# EAGLE design untitled (EAGLE 6.1)
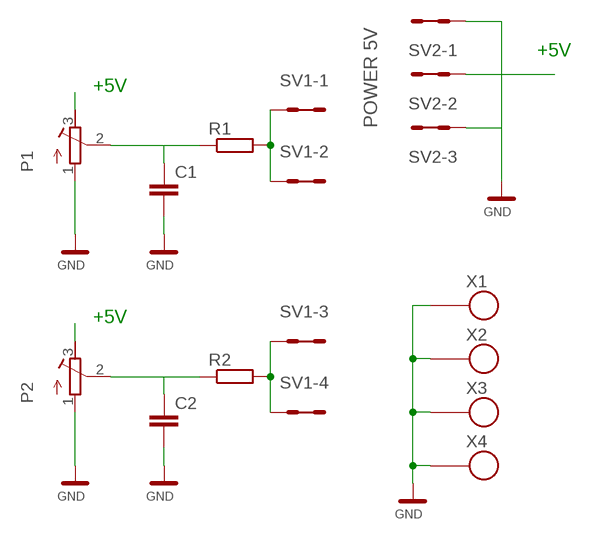
[diagram p0: schematic, sheet 1]

## Parts
C1  C0805  [C0805]
C2  C0805  [C0805]
P1  TRIM_CA9MTV10  [TRIM_CA9MTV10]
P2  TRIM_CA9MTV10  [TRIM_CA9MTV10]
R1  R0805  [0805]
R2  R0805  [0805]
SV1  MA04-2  [MA04-2]
SV2  MA03-2  [MA03-2]
X1  SROUB3M  [SROUB3M]
X2  SROUB3M  [SROUB3M]
X3  SROUB3M  [SROUB3M]
X4  SROUB3M  [SROUB3M]

## Nets
+5V: P1.3 P2.3 SV2.3 SV2.4
GND: C1.2 C2.2 P1.1 P2.1 SV2.1 SV2.2 SV2.5 SV2.6 X1.P$1 X2.P$1 X3.P$1 X4.P$1
N$1: R2.2 SV1.5 SV1.6 SV1.7 SV1.8
N$2: C1.1 P1.2 R1.1
N$4: R1.2 SV1.1 SV1.2 SV1.3 SV1.4
N$5: C2.1 P2.2 R2.1

## Notes on the sheet
- +5V
- +5V
- POWER 5V
- +5V

## Library data of the parts
C1 C2 = moje_C:C0805
P1 P2 = moje_pot:TRIM_CA9MTV10
R1 R2 = moje_R:R0805
SV1 = moje_hrebinky:MA04-2: PIN HEADER; OC_FARNELL: unknown; OC_NEWARK: unknown
SV2 = moje_hrebinky:MA03-2: PIN HEADER; OC_FARNELL: unknown; OC_NEWARK: unknown
X1-X4 = moje:SROUB3M

## Board
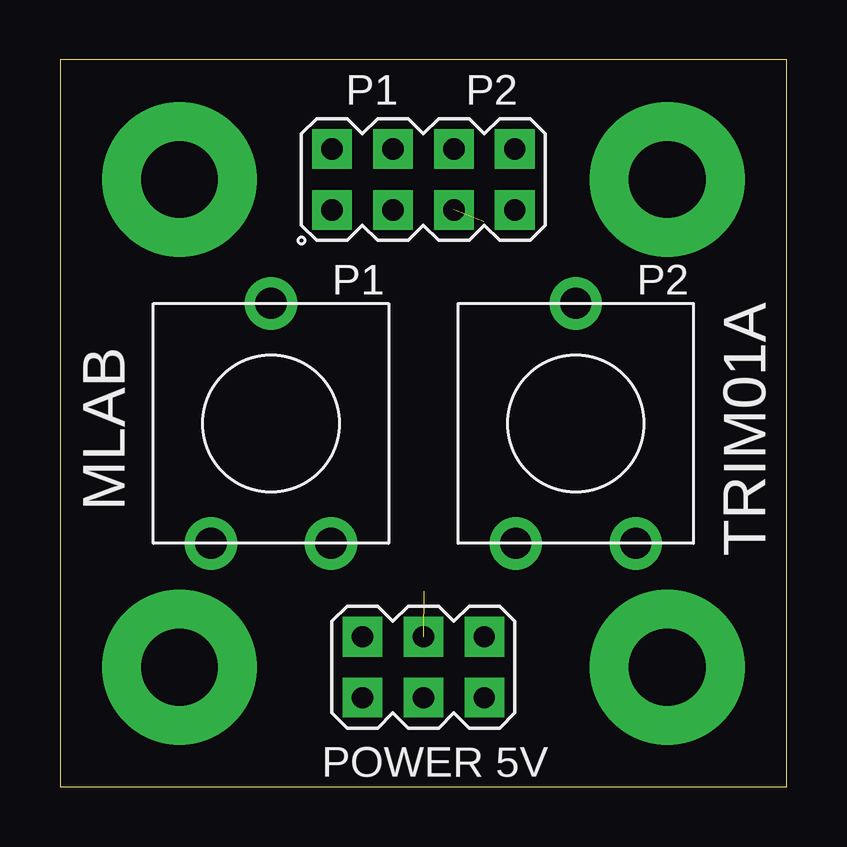
[diagram p1: board, top side]
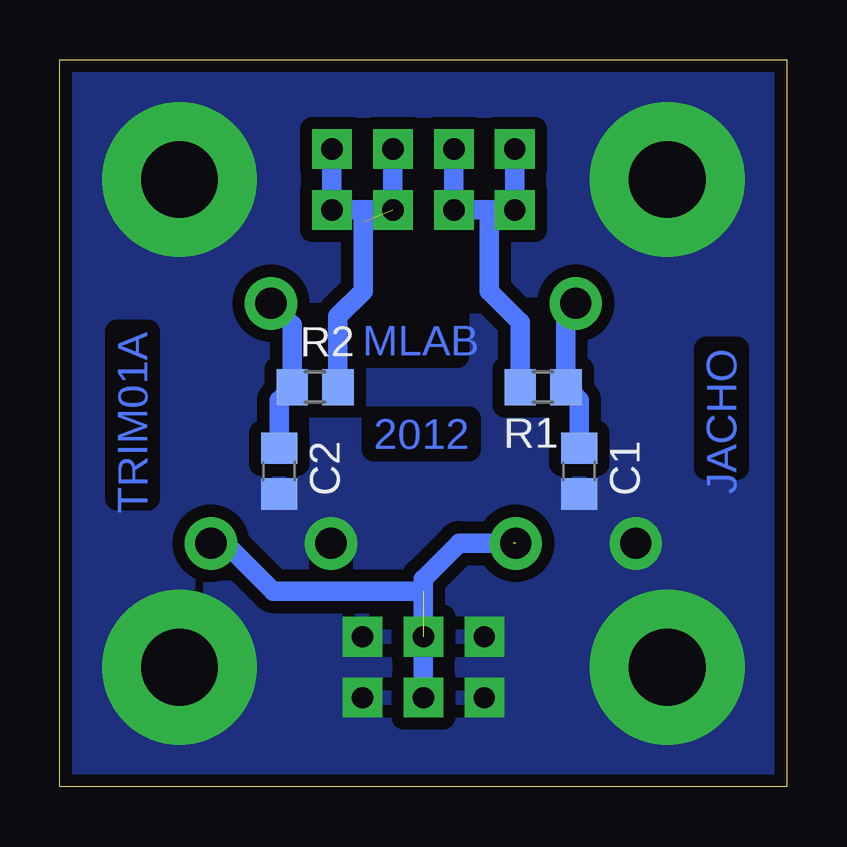
[diagram p2: board, bottom side, seen from below]

Size 30.28 x 30.28 mm. Coordinates in mm from the lower left corner, seen from the top.
Outline: 0,0 30.28,0 30.28,30.28 0,30.28 0,0
Copper layers (1*16): Top 0.035mm / dielectric 1mm / Bottom 0.035mm
Design rules: minimum track width 12mil, minimum drill 24mil, track to track 20mil, track to pad 20mil, pad to pad 20mil, via to via 20mil, smd to smd 8mil, copper to edge 20mil, drill to drill 70mil, minimum pad ring 10mil, minimum via ring 8mil, stop-mask expansion 5mil, vias tented up to drill 0mil, thermal gap 0mil

### Footprints (pad centres in the part's own frame; a part is rotated, then mirrored left to right if it is on the bottom)
C0805 = smd 1.3 x 1.5: 1 -0.95,0; 2 0.95,0
TRIM_CA9MTV10 = drill 1.3 pad 2.184: 1 -2.5,-5; 2 0,5; 3 2.5,-5
0805 = smd 1.3 x 1.5: 1 -0.95,0; 2 0.95,0
MA04-2 = drill 0.889 pad 1.651 square: 1 -3.81,-1.27; 2 -3.81,1.27; 3 -1.27,-1.27; 4 -1.27,1.27; 5 1.27,-1.27; 6 1.27,1.27; 7 3.81,-1.27; 8 3.81,1.27
MA03-2 = drill 0.889 pad 1.651 square: 1 -2.54,-1.27; 2 -2.54,1.27; 3 0,-1.27; 4 0,1.27; 5 2.54,-1.27; 6 2.54,1.27
SROUB3M = drill 3.2 pad 6.452: P$1 0,0

### Placement (x,y rotation side)
C1  8.65,13.15 270 bottom
C2  21.15,13.15 270 bottom
P1  8.79,15.14 0 top
P2  21.49,15.14 0 top
R1  10.15,16.65 180 bottom
R2  19.65,16.65 0 bottom
SV1  15.14,25.3 0 top
SV2  15.14,4.98 0 top
X1  25.3,4.98 0 top
X2  4.98,25.3 0 top
X3  25.3,25.3 0 top
X4  4.98,4.98 0 top

### Tracks (layer width: path | path; a pad name or v marks a point on that pad's centre or on a via)
+5V  (2 unrouted)
  Bottom 0.61: SV2.3
  Bottom 0.813: SV2.3 15.15,8.15 | 15.15,8.15 15.15,8.65 13.65,10.15 11.4,10.15 | P2.3 23.39,10.14 21.4,8.15 15.15,8.15
GND
  pour Bottom: -0.1,30.4 30.4,30.4 30.4,-0.1 -0.1,-0.1
N$1  (1 unrouted)
  Bottom 0.813: R2.2 18.7,19.6 17.65,20.65 17.65,23.53 | SV1.6 SV1.5 SV1.7 SV1.8
N$2
  Bottom 0.813: C1.1 8.65,16.1 R1.1 9.2,19.73 P1.2
N$4
  Bottom 0.813: R1.2 11.1,19.35 12.4,20.65 12.4,24.03 | SV1.2 SV1.1 12.4,24.03 | 12.4,24.03 SV1.3 SV1.4
N$5
  Bottom 0.813: C2.1 21.15,16.1 R2.1 20.6,19.25 P2.2

### Text on the board
Bottom: TRIM01A | JACHO | MLAB | 2012
tPlace: P1 | P2 | MLAB | TRIM01A | POWER 5V